# EAGLE schematic led (EAGLE 7.6.0)
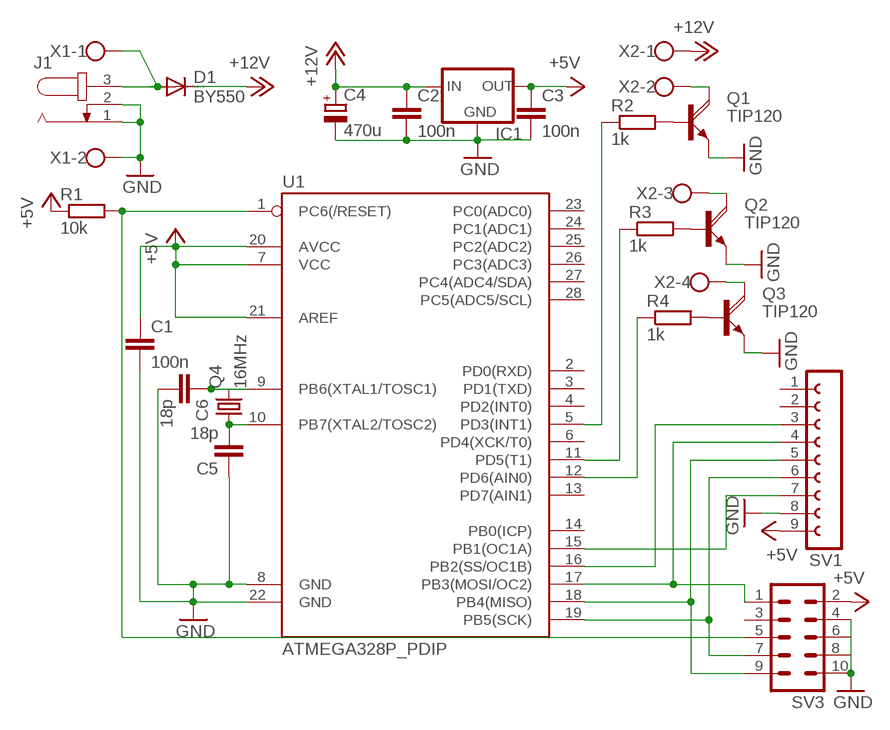
[diagram p0: schematic, sheet 1]

## Parts
C1  100n  C-EU050-024X044  [C050-024X044]
C2  100n  C-EU050-024X044  [C050-024X044]
C3  100n  C-EU050-024X044  [C050-024X044]
C4  470u  CPOL-EUE5-10.5  [E5-10,5]
C5  18p  C-EU050-024X044  [C050-024X044]
C6  18p  C-EU050-024X044  [C050-024X044]
D1  BY550  [DO27-15]
IC1  78XXS  [78XXS]
J1  JACK-PLUG1  [SPC4078]
Q1  TIP120  [TO220AV]
Q2  TIP120  [TO220AV]
Q3  TIP120  [TO220AV]
Q4  16MHz  CRYSTALHC49S  [HC49/S]
R1  10k  R-EU_0207/10  [0207/10]
R2  1k  R-EU_0207/10  [0207/10]
R3  1k  R-EU_0207/10  [0207/10]
R4  1k  R-EU_0207/10  [0207/10]
SV1  FE09-1  [FE09]
SV3  MA05-2  [MA05-2]
U1  ATMEGA328P_PDIP  [DIL28-3]
X1  W237-102  [W237-102]
X2  W237-4  [W237-4]

## Nets
+5V: C1.1 C3.1 IC1.OUT R1.1 SV1.9 SV3.2 U1.7(VCC) U1.20(AVCC) U1.21(AREF)
+12V [3amp]: C2.1 C4.+ D1.C IC1.IN X2.1
GND: C1.2 C2.2 C3.2 C4.- C5.1 C6.2 IC1.GND J1.1 J1.2 Q1.E Q2.E Q3.E SV1.8 SV3.4 SV3.10 U1.8(GND) U1.22(GND) X1.2
N$1 [3amp]: Q3.C X2.4
N$2: SV1.5 SV3.9 U1.18(PB4(MISO))
N$3 [3amp]: D1.A J1.3 X1.1
N$4: Q1.B R2.2
N$5: R1.2 SV3.5 U1.1(PC6(/RESET))
N$6: SV1.4 SV3.1 U1.17(PB3(MOSI/OC2))
N$7: SV1.3 U1.16(PB2(SS/OC1B))
N$8: SV1.7 U1.15(PB1(OC1A))
N$9 [3amp]: Q2.C X2.3
N$10 [3amp]: Q1.C X2.2
N$11: R4.1 U1.12(PD6(AIN0))
N$12: R3.1 U1.11(PD5(T1))
N$13: R2.1 U1.5(PD3(INT1))
N$14: SV1.6 SV3.7 U1.19(PB5(SCK))
N$15: Q2.B R3.2
N$16: Q3.B R4.2
N$17: C6.1 Q4.2 U1.9(PB6(XTAL1/TOSC1))
N$18: C5.2 Q4.1 U1.10(PB7(XTAL2/TOSC2))
Unconnected: SV1.1 SV1.2 SV3.3 SV3.6 SV3.8 U1.2(PD0(RXD)) U1.3(PD1(TXD)) U1.4(PD2(INT0)) U1.6(PD4(XCK/T0)) U1.13(PD7(AIN1)) U1.14(PB0(ICP)) U1.23(PC0(ADC0)) U1.24(PC1(ADC1)) U1.25(PC2(ADC2)) U1.26(PC3(ADC3)) U1.27(PC4(ADC4/SDA)) U1.28(PC5(ADC5/SCL))

## Library data of the parts
C1-C3 C5 C6 = rcl:C-EU: CAPACITOR, European symbol
C4 = rcl:CPOL-EU: POLARIZED CAPACITOR, European symbol
D1 = diode:BY550: DIODE Si200 V, 5 A
IC1 = v-reg:78XXS: VOLTAGE REGULATOR
J1 = con-jack:JACK-PLUG: DC POWER JACK Power Jack, DC, Right Angle, Through Hole, Rated 5A at 16VDC, PC Terminals Distributor: Farnell (www.Farnell.de) Drawing: 84N1161.pdf / 84N1162.pdf Manufacturer: SPC Technology (www.spctechnology.com) Type: SPC4077 / SPC 4078; OC_FARNELL: unknown; OC_NEWARK: unknown
Q1-Q3 = transistor-power:TIP120: NPN DARLINGTON TRANSISTOR
Q4 = crystal:CRYSTAL: CRYSTAL; OC_FARNELL: 1667008; OC_NEWARK: unknown
R1 = resistor:R-EU_: RESISTOR, European symbol
R2-R4 = rcl:R-EU_: RESISTOR, European symbol
SV1 = con-lsta:FE09-1: FEMALE HEADER; OC_FARNELL: unknown; OC_NEWARK: unknown
SV3 = con-lstb:MA05-2: PIN HEADER; OC_FARNELL: unknown; OC_NEWARK: unknown
U1 = SparkFun-DigitalIC:ATMEGA328P_PDIP: uC used in the Arduino 32kb flash, 1k EEPROM, 2k SRAM This is the through-hole version of this chip.
X1 = con-wago-500:W237-102: WAGO SCREW CLAMP; MPN: 237-102; OC_FARNELL: unknown; OC_NEWARK: 70K9898
X2 = con-wago-500:W237-4: WAGO SCREW CLAMP; OC_FARNELL: unknown; OC_NEWARK: unknown

## Net classes
0 default: width 0.61 mm, clearance 0.61 mm
1 3amp: width 1.219 mm, clearance 0.813 mm